# EAGLE schematic Wheelchair (EAGLE 5.11)
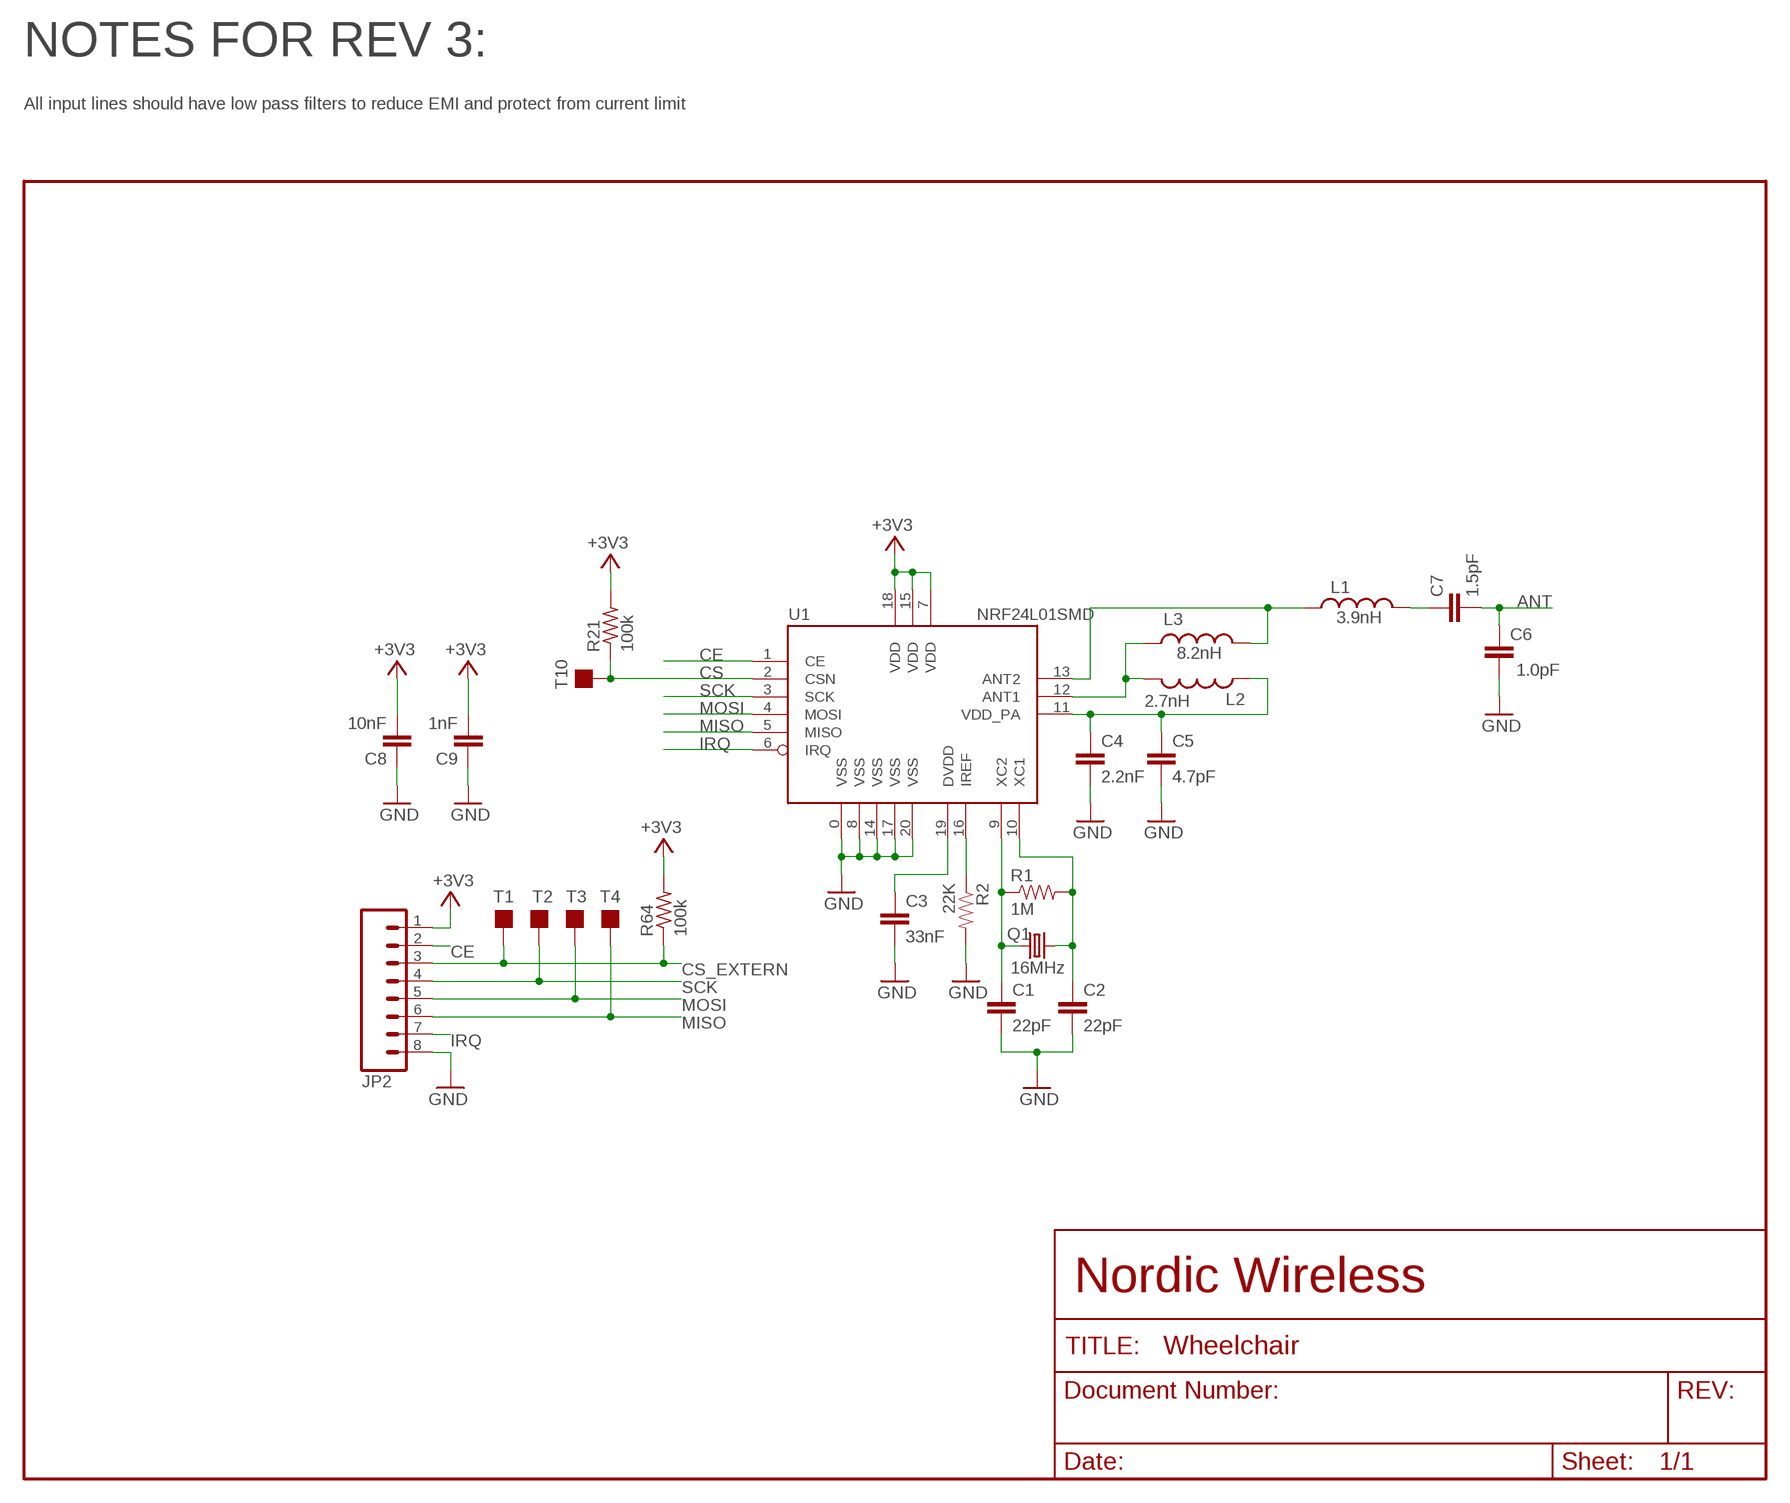
[diagram p0: schematic, sheet 1, part 1 of 3]
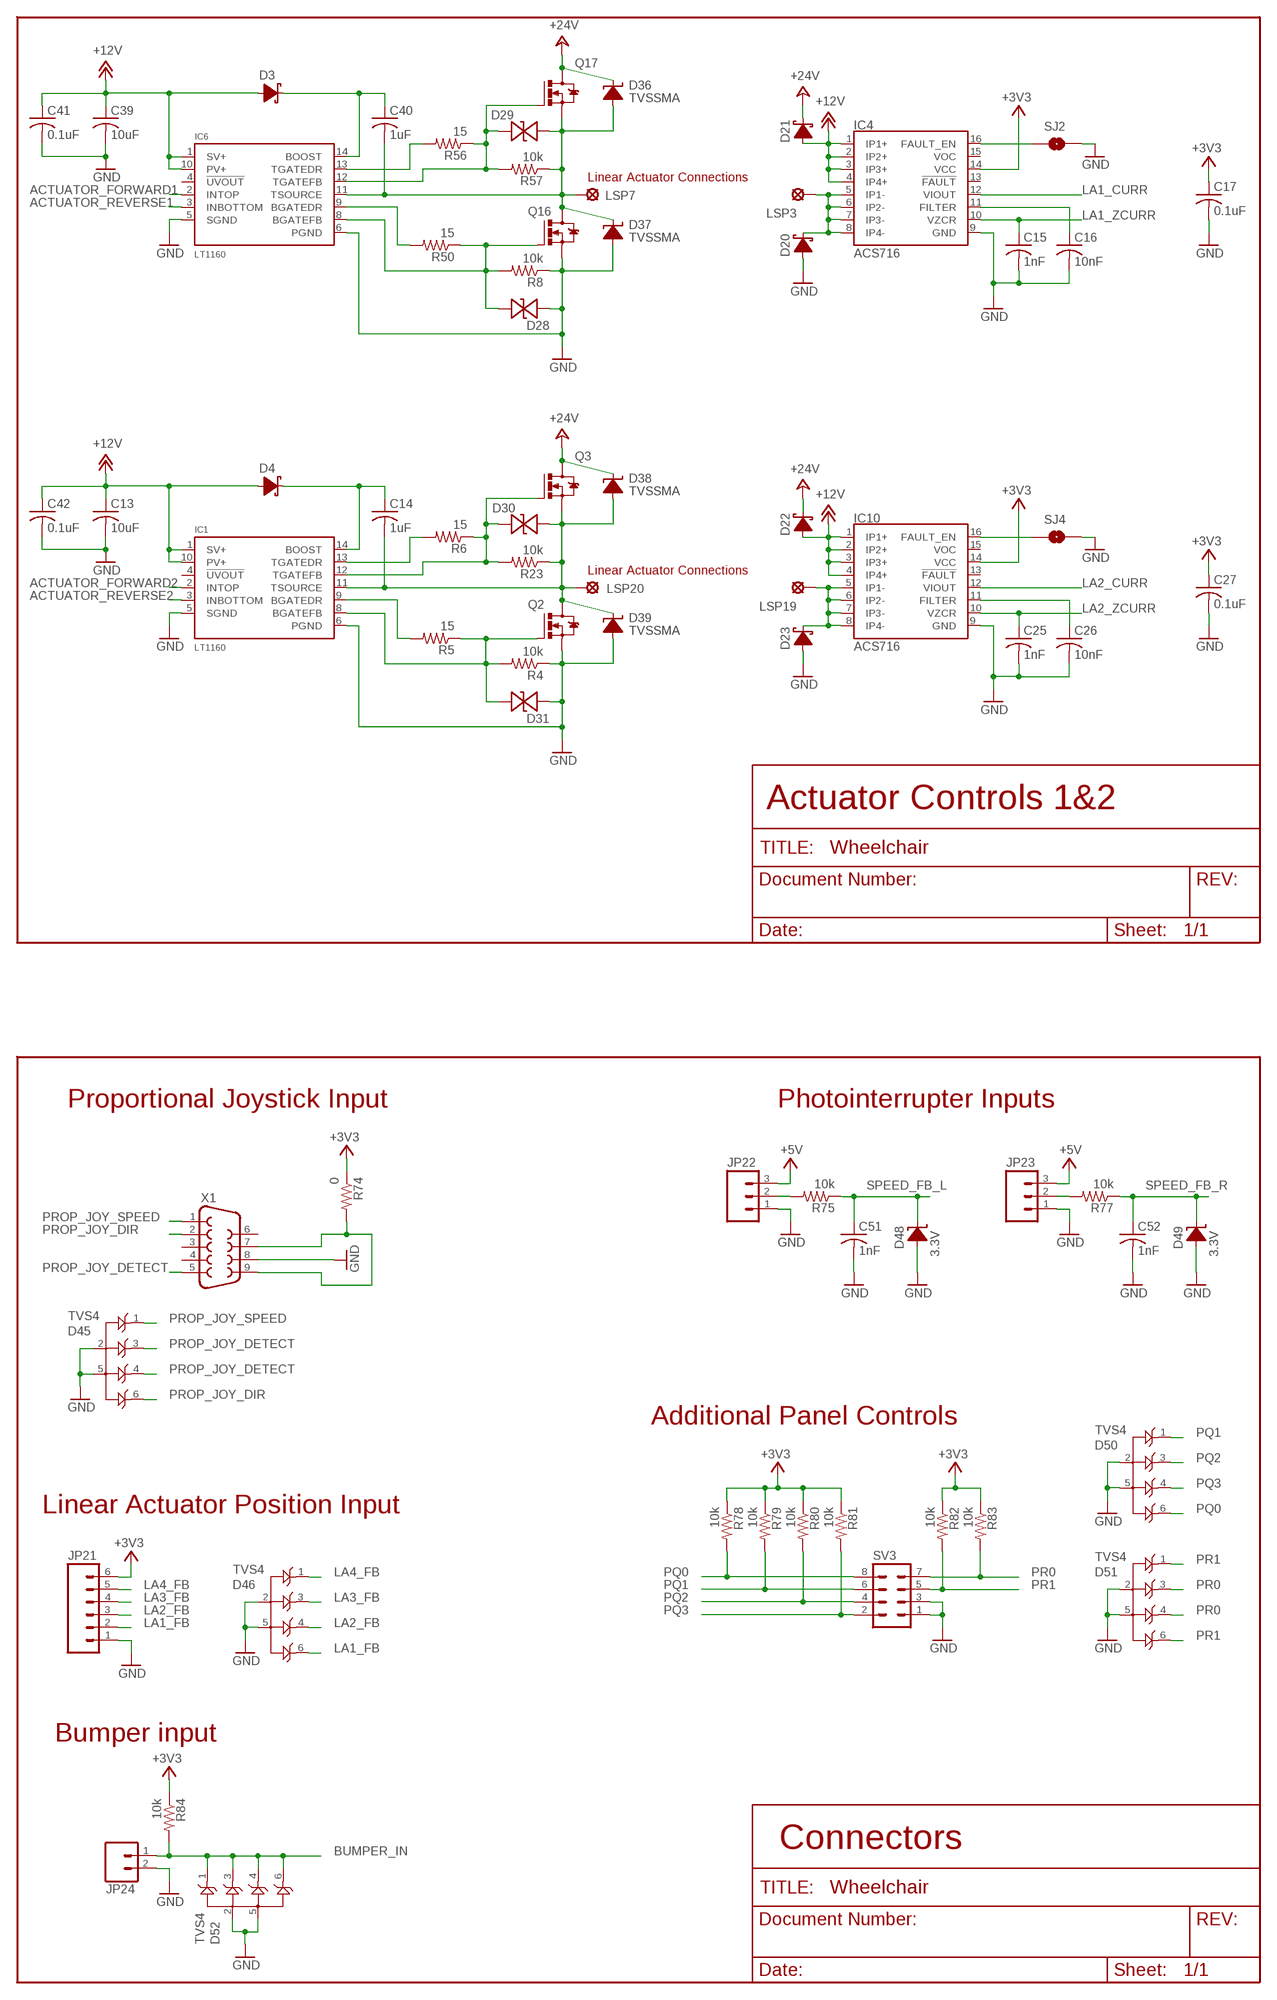
[diagram p1: schematic, sheet 1, part 2 of 3]
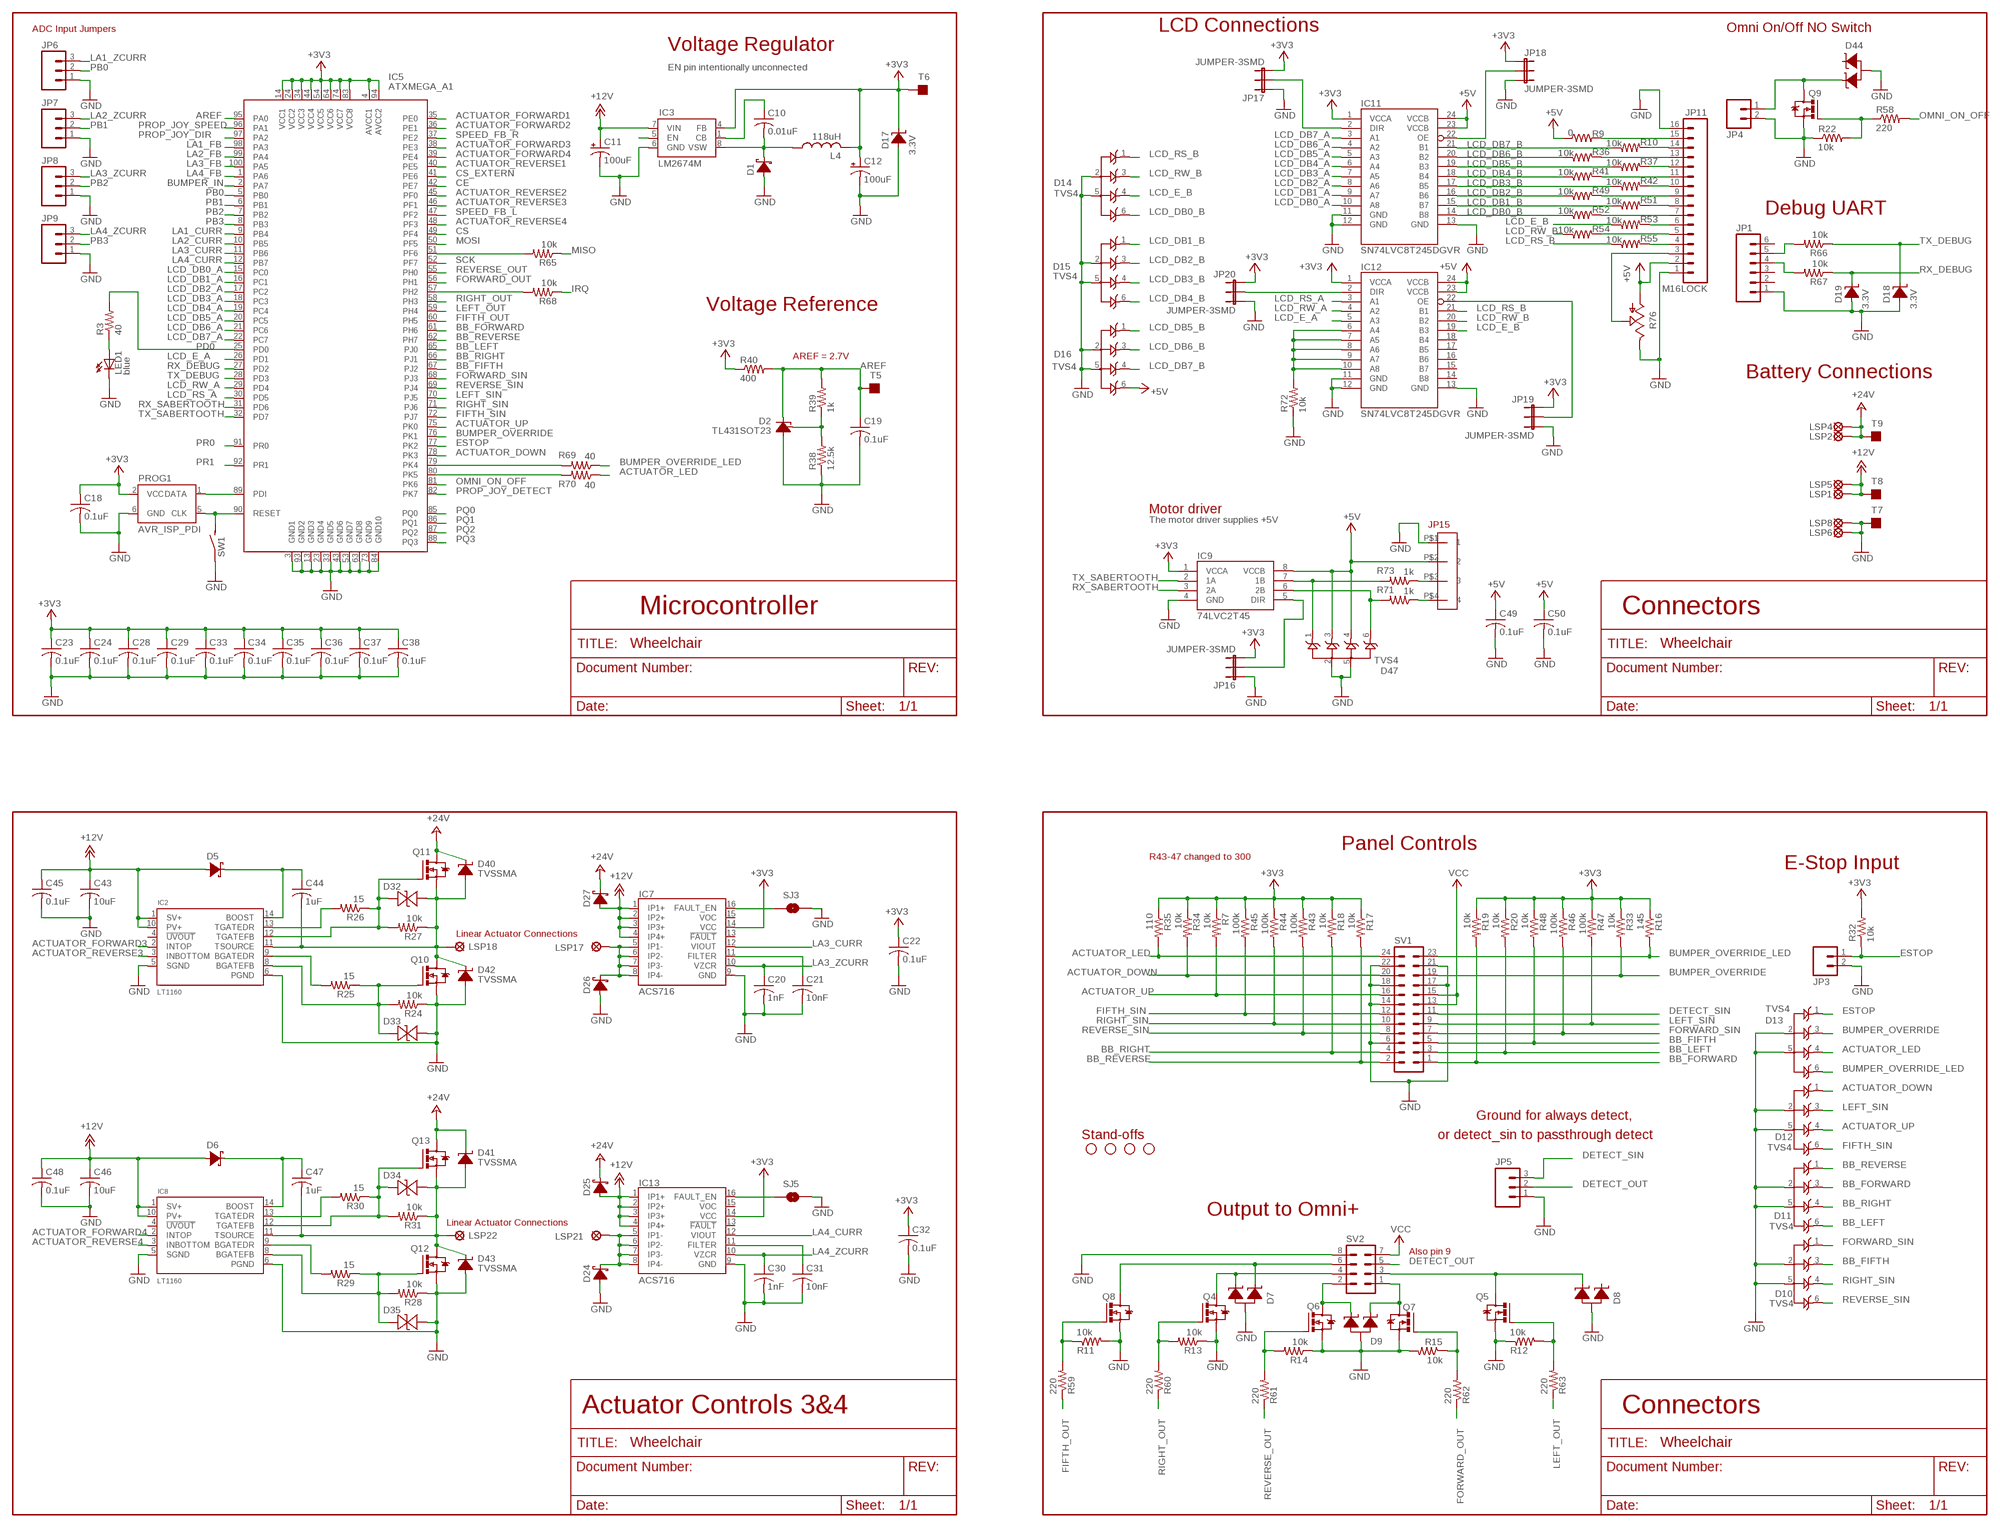
[diagram p2: schematic, sheet 1, part 3 of 3]

## Parts
C1  22pF  CAP0402  [C0402]
C2  22pF  CAP0402  [C0402]
C3  33nF  CAP0402  [C0402]
C4  2.2nF  CAP0402  [C0402]
C5  4.7pF  CAP0402  [C0402]
C6  1.0pF  CAP0402  [C0402]
C7  1.5pF  CAP0402  [C0402]
C8  10nF  CAP0402  [C0402]
C9  1nF  CAP0402  [C0402]
C10  0.01uF  C-USC0805  [C0805]
C11  100uF  CPOL-US2312  [CPOL2312]
C12  100uF  CPOL-US2312  [CPOL2312]
C13  10uF  C-USC0805  [C0805]
C14  1uF  C-USC0805  [C0805]
C15  1nF  C-USC0805  [C0805]
C16  10nF  C-USC0805  [C0805]
C17  0.1uF  C-USC0805  [C0805]
C18  0.1uF  C-USC0805  [C0805]
C19  0.1uF  C-USC0805  [C0805]
C20  1nF  C-USC0805  [C0805]
C21  10nF  C-USC0805  [C0805]
C22  0.1uF  C-USC0805  [C0805]
C23  0.1uF  C-USC0805  [C0805]
C24  0.1uF  C-USC0805  [C0805]
C25  1nF  C-USC0805  [C0805]
C26  10nF  C-USC0805  [C0805]
C27  0.1uF  C-USC0805  [C0805]
C28  0.1uF  C-USC0805  [C0805]
C29  0.1uF  C-USC0805  [C0805]
C30  1nF  C-USC0805  [C0805]
C31  10nF  C-USC0805  [C0805]
C32  0.1uF  C-USC0805  [C0805]
C33  0.1uF  C-USC0805  [C0805]
C34  0.1uF  C-USC0805  [C0805]
C35  0.1uF  C-USC0805  [C0805]
C36  0.1uF  C-USC0805  [C0805]
C37  0.1uF  C-USC0805  [C0805]
C38  0.1uF  C-USC0805  [C0805]
C39  10uF  C-USC0805  [C0805]
C40  1uF  C-USC0805  [C0805]
C41  0.1uF  C-USC0805  [C0805]
C42  0.1uF  C-USC0805  [C0805]
C43  10uF  C-USC0805  [C0805]
C44  1uF  C-USC0805  [C0805]
C45  0.1uF  C-USC0805  [C0805]
C46  10uF  C-USC0805  [C0805]
C47  1uF  C-USC0805  [C0805]
C48  0.1uF  C-USC0805  [C0805]
C49  0.1uF  C-USC0805  [C0805]
C50  0.1uF  C-USC0805  [C0805]
C51  1nF  C-USC0805  [C0805]
C52  1nF  C-USC0805  [C0805]
D1  DIODE-SCHOTTKYSMA  [SMA]
D2  TL431SOT23  [SOT-23]
D3  DIODE-SCHOTTKYSMA  [SMA]
D4  DIODE-SCHOTTKYSMA  [SMA]
D5  DIODE-SCHOTTKYSMA  [SMA]
D6  DIODE-SCHOTTKYSMA  [SMA]
D7  ZENER_COMMON_ANODE  [SOT23]
D8  ZENER_COMMON_ANODE  [SOT23]
D9  ZENER_COMMON_ANODE  [SOT23]
D10  TVS4  [SC89]
D11  TVS4  [SC89]
D12  TVS4  [SC89]
D13  TVS4  [SC89]
D14  TVS4  [SC89]
D15  TVS4  [SC89]
D16  TVS4  [SC89]
D17  3.3V  ZENERMINIMELF  [MINIMELF]
D18  3.3V  ZENERMINIMELF  [MINIMELF]
D19  3.3V  ZENERMINIMELF  [MINIMELF]
D20  DIODE-SCHOTTKYSMC  [SMC]
D21  DIODE-SCHOTTKYSMC  [SMC]
D22  DIODE-SCHOTTKYSMC  [SMC]
D23  DIODE-SCHOTTKYSMC  [SMC]
D24  DIODE-SCHOTTKYSMC  [SMC]
D25  DIODE-SCHOTTKYSMC  [SMC]
D26  DIODE-SCHOTTKYSMC  [SMC]
D27  DIODE-SCHOTTKYSMC  [SMC]
D28  TVSBISMB  [SMBBI]
D29  TVSBISMB  [SMBBI]
D30  TVSBISMB  [SMBBI]
D31  TVSBISMB  [SMBBI]
D32  TVSBISMB  [SMBBI]
D33  TVSBISMB  [SMBBI]
D34  TVSBISMB  [SMBBI]
D35  TVSBISMB  [SMBBI]
D36  TVSSMA  [SMA]
D37  TVSSMA  [SMA]
D38  TVSSMA  [SMA]
D39  TVSSMA  [SMA]
D40  TVSSMA  [SMA]
D41  TVSSMA  [SMA]
D42  TVSSMA  [SMA]
D43  TVSSMA  [SMA]
D44  ZENER_COMMON_ANODE  [SOT23]
D45  TVS4  [SC89]
D46  TVS4  [SC89]
D47  TVS4  [SC89]
D48  3.3V  ZENERMINIMELF  [MINIMELF]
D49  3.3V  ZENERMINIMELF  [MINIMELF]
D50  TVS4  [SC89]
D51  TVS4  [SC89]
D52  TVS4  [SC89]
IC1  LT1160  [SO14]
IC2  LT1160  [SO14]
IC3  LM2674M  [SOIC8_3.9MM]
IC4  ACS716  ACS710  [SOIC16W]
IC5  ATXMEGA_A1  [TQFP100]
IC6  LT1160  [SO14]
IC7  ACS716  ACS710  [SOIC16W]
IC8  LT1160  [SO14]
IC9  74LVC2T45  74LVC2T45DC  [VSSOP8]
IC10  ACS716  ACS710  [SOIC16W]
IC11  SN74LVC8T245DGVR  [TVSOP24]
IC12  SN74LVC8T245DGVR  [TVSOP24]
IC13  ACS716  ACS710  [SOIC16W]
JP1  M06LOCK  [1X06_LOCK]
JP2  M08LOCK  [1X08_LOCK]
JP3  M02PTH  [1X02]
JP4  M02PTH  [1X02]
JP5  M03LOCK  [1X03_LOCK]
JP6  M03LOCK  [1X03_LOCK]
JP7  M03LOCK  [1X03_LOCK]
JP8  M03LOCK  [1X03_LOCK]
JP9  M03LOCK  [1X03_LOCK]
JP10  STAND-OFF  [STAND-OFF]
JP11  M16LOCK  [1X16_LOCK]
JP12  STAND-OFF  [STAND-OFF]
JP13  STAND-OFF  [STAND-OFF]
JP14  STAND-OFF  [STAND-OFF]
JP15  4PINH0.197  [4PINH0.197]
JP16  JUMPER-3SMD  [SJ_3]
JP17  JUMPER-3SMD  [SJ_3]
JP18  JUMPER-3SMD  [SJ_3]
JP19  JUMPER-3SMD  [SJ_3]
JP20  JUMPER-3SMD  [SJ_3]
JP21  M06LOCK  [1X06_LOCK]
JP22  M03LOCK  [1X03_LOCK]
JP23  M03LOCK  [1X03_LOCK]
JP24  M02PTH  [1X02]
L1  3.9nH  INDUCTOR0402  [C0402]
L2  2.7nH  INDUCTOR0402  [C0402]
L3  8.2nH  INDUCTOR0402  [C0402]
L4  118uH  L-USLCI  [LCI_SERIES_PULSE_EGR]
LED1  blue  LED0805  [D0805]
LSP1  SE14  [SE14]
LSP2  SE14  [SE14]
LSP3  SE14  [SE14]
LSP4  SE14  [SE14]
LSP5  SE14  [SE14]
LSP6  SE14  [SE14]
LSP7  SE14  [SE14]
LSP8  SE14  [SE14]
LSP17  SE14  [SE14]
LSP18  SE14  [SE14]
LSP19  SE14  [SE14]
LSP20  SE14  [SE14]
LSP21  SE14  [SE14]
LSP22  SE14  [SE14]
PROG1  AVR_ISP_PDI  [CON6P2R]
Q1  16MHz  CRYSTAL5X3  [CRYSTAL-SMD-5X3]
Q2  MOSFET-NTO252  [TO252]
Q3  MOSFET-NTO252  [TO252]
Q4  MOSFET-N.SOT23  [SOT-23]
Q5  MOSFET-N.SOT23  [SOT-23]
Q6  MOSFET-N.SOT23  [SOT-23]
Q7  MOSFET-N.SOT23  [SOT-23]
Q8  MOSFET-N.SOT23  [SOT-23]
Q9  MOSFET-N.SOT23  [SOT-23]
Q10  MOSFET-NTO252  [TO252]
Q11  MOSFET-NTO252  [TO252]
Q12  MOSFET-NTO252  [TO252]
Q13  MOSFET-NTO252  [TO252]
Q16  MOSFET-NTO252  [TO252]
Q17  MOSFET-NTO252  [TO252]
R1  1M  RESISTOR0402  [C0402]
R2  22K  RESISTOR0402  [C0402]
R3  40  R-US_R0805  [R0805]
R4  10k  R-US_R0805  [R0805]
R5  15  R-US_R0805  [R0805]
R6  15  R-US_R0805  [R0805]
R7  10k  R-US_R0805  [R0805]
R8  10k  R-US_R0805  [R0805]
R9  0  R-US_R0805  [R0805]
R10  10k  R-US_R0805  [R0805]
R11  10k  R-US_R0805  [R0805]
R12  10k  R-US_R0805  [R0805]
R13  10k  R-US_R0805  [R0805]
R14  10k  R-US_R0805  [R0805]
R15  10k  R-US_R0805  [R0805]
R16  145  R-US_R0805  [R0805]
R17  10k  R-US_R0805  [R0805]
R18  10k  R-US_R0805  [R0805]
R19  10k  R-US_R0805  [R0805]
R20  10k  R-US_R0805  [R0805]
R21  100k  R-US_R0805  [R0805]
R22  10k  R-US_R0805  [R0805]
R23  10k  R-US_R0805  [R0805]
R24  10k  R-US_R0805  [R0805]
R25  15  R-US_R0805  [R0805]
R26  15  R-US_R0805  [R0805]
R27  10k  R-US_R0805  [R0805]
R28  10k  R-US_R0805  [R0805]
R29  15  R-US_R0805  [R0805]
R30  15  R-US_R0805  [R0805]
R31  10k  R-US_R0805  [R0805]
R32  10k  R-US_R0805  [R0805]
R33  10k  R-US_R0805  [R0805]
R34  10k  R-US_R0805  [R0805]
R35  110  R-US_R0805  [R0805]
R36  10k  R-US_R0805  [R0805]
R37  10k  R-US_R0805  [R0805]
R38  12.5k  R-US_R0805  [R0805]
R39  1k  R-US_R0805  [R0805]
R40  400  R-US_R0805  [R0805]
R41  10k  R-US_R0805  [R0805]
R42  10k  R-US_R0805  [R0805]
R43  100k  R-US_R0805  [R0805]
R44  100k  R-US_R0805  [R0805]
R45  100k  R-US_R0805  [R0805]
R46  100k  R-US_R0805  [R0805]
R47  100k  R-US_R0805  [R0805]
R48  10k  R-US_R0805  [R0805]
R49  10k  R-US_R0805  [R0805]
R50  15  R-US_R0805  [R0805]
R51  10k  R-US_R0805  [R0805]
R52  10k  R-US_R0805  [R0805]
R53  10k  R-US_R0805  [R0805]
R54  10k  R-US_R0805  [R0805]
R55  10k  R-US_R0805  [R0805]
R56  15  R-US_R0805  [R0805]
R57  10k  R-US_R0805  [R0805]
R58  220  R-US_R0805  [R0805]
R59  220  R-US_R0805  [R0805]
R60  220  R-US_R0805  [R0805]
R61  220  R-US_R0805  [R0805]
R62  220  R-US_R0805  [R0805]
R63  220  R-US_R0805  [R0805]
R64  100k  R-US_R0805  [R0805]
R65  10k  R-US_R0805  [R0805]
R66  10k  R-US_R0805  [R0805]
R67  10k  R-US_R0805  [R0805]
R68  10k  R-US_R0805  [R0805]
R69  40  R-US_R0805  [R0805]
R70  40  R-US_R0805  [R0805]
R71  1k  R-US_R0805  [R0805]
R72  10k  R-US_R0805  [R0805]
R73  1k  R-US_R0805  [R0805]
R74  0  R-US_R0805  [R0805]
R75  10k  R-US_R0805  [R0805]
R76  TRIM_US-B25P  [B25P]
R77  10k  R-US_R0805  [R0805]
R78  10k  R-US_R0805  [R0805]
R79  10k  R-US_R0805  [R0805]
R80  10k  R-US_R0805  [R0805]
R81  10k  R-US_R0805  [R0805]
R82  10k  R-US_R0805  [R0805]
R83  10k  R-US_R0805  [R0805]
R84  10k  R-US_R0805  [R0805]
SJ2  SOLDERJUMPERNO  [SJ_2S-NO]
SJ3  SOLDERJUMPERNO  [SJ_2S-NO]
SJ4  SOLDERJUMPERNO  [SJ_2S-NO]
SJ5  SOLDERJUMPERNO  [SJ_2S-NO]
SV1  MA12-2  [MA12-2]
SV2  MA04-2  [MA04-2]
SV3  MA04-2  [MA04-2]
SW1  TL1015  [TL1015]
T1  TESTPOINT40  [TP40MIL]
T2  TESTPOINT40  [TP40MIL]
T3  TESTPOINT40  [TP40MIL]
T4  TESTPOINT40  [TP40MIL]
T5  TESTPOINT40  [TP40MIL]
T6  TESTPOINT40  [TP40MIL]
T7  TESTPOINT40  [TP40MIL]
T8  TESTPOINT40  [TP40MIL]
T9  TESTPOINT40  [TP40MIL]
T10  TESTPOINT40  [TP40MIL]
U1  NRF24L01SMD  [QFN20]
X1  F09V  [F09V]

## Nets
3V3ONOFF: IC3.5(EN)
+3V3: C8.2 C9.2 C12.+ C17.1 C18.1 C22.1 C23.1 C24.1 C27.1 C28.1 C29.1 C32.1 C33.1 C34.1 C35.1 C36.1 C37.1 C38.1 D17.C IC3.4(FB) IC4.14(VCC) IC5.4(AVCC1) IC5.14(VCC1) IC5.24(VCC2) IC5.34(VCC3) IC5.44(VCC4) IC5.54(VCC5) IC5.64(VCC6) IC5.74(VCC7) IC5.83(VCC8) IC5.94(AVCC2) IC7.14(VCC) IC9.1(VCCA) IC10.14(VCC) IC11.1(VCCA) IC12.1(VCCA) IC13.14(VCC) JP2.1 JP16.3 JP17.3 JP18.1 JP19.1 JP20.1 JP21.6 L4.P$2 PROG1.2(VCC) R7.1 R16.1 R17.1 R18.1 R19.1 R20.1 R21.2 R32.2 R33.1 R34.1 R35.1 R40.1 R43.1 R44.1 R45.1 R46.1 R47.1 R48.1 R64.2 R74.1 R78.1 R79.1 R80.1 R81.1 R82.1 R83.1 R84.1 T6.1 U1.7(VDD) U1.15(VDD) U1.18(VDD)
+5V: C49.1 C50.1 D16.6 D47.3 D47.4 IC9.8(VCCB) IC11.23(VCCB) IC11.24(VCCB) IC12.23(VCCB) IC12.24(VCCB) JP11.2 JP15.P$2 JP22.3 JP23.3 R9.1 R76.A
+12V: C11.+ C13.1 C39.1 C41.1 C42.1 C43.1 C45.1 C46.1 C48.1 D3.A D4.A D5.A D6.A D21.A D22.A D25.A D27.A IC1.1(SV+) IC1.10(PV+) IC2.1(SV+) IC2.10(PV+) IC3.7(VIN) IC4.1(IP1+) IC4.2(IP2+) IC4.3(IP3+) IC4.4(IP4+) IC6.1(SV+) IC6.10(PV+) IC7.1(IP1+) IC7.2(IP2+) IC7.3(IP3+) IC7.4(IP4+) IC8.1(SV+) IC8.10(PV+) IC10.1(IP1+) IC10.2(IP2+) IC10.3(IP3+) IC10.4(IP4+) IC13.1(IP1+) IC13.2(IP2+) IC13.3(IP3+) IC13.4(IP4+) LSP1.MP LSP5.MP T8.1
+24V: D21.C D22.C D25.C D27.C D36.C D38.C D40.C D41.C LSP2.MP LSP4.MP Q3.3(D) Q11.3(D) Q13.3(D) Q17.3(D) T9.1
ACTUATOR_DOWN: D12.1 IC5.78(PK3) R34.2 SV1.20
ACTUATOR_FORWARD1: IC5.35(PE0) IC6.2(INTOP)
ACTUATOR_FORWARD2: IC1.2(INTOP) IC5.36(PE1)
ACTUATOR_FORWARD3: IC2.2(INTOP) IC5.38(PE3)
ACTUATOR_FORWARD4: IC5.39(PE4) IC8.2(INTOP)
ACTUATOR_LED: D13.4 R35.2 R70.1 SV1.24
ACTUATOR_REVERSE1: IC5.40(PE5) IC6.3(INBOTTOM)
ACTUATOR_REVERSE2: IC1.3(INBOTTOM) IC5.45(PF0)
ACTUATOR_REVERSE3: IC2.3(INBOTTOM) IC5.46(PF1)
ACTUATOR_REVERSE4: IC5.48(PF3) IC8.3(INBOTTOM)
ACTUATOR_UP: D12.4 IC5.75(PK0) R7.2 SV1.16
ANT: C6.2 C7.2
AREF: C19.1 D2.1(K) IC5.95(PA0) R39.2 R40.2 T5.1
BB_FIFTH: D10.3 IC5.67(PJ2) R48.2 SV1.5
BB_FORWARD: D11.3 IC5.61(PH6) R19.2 SV1.1
BB_LEFT: D11.6 IC5.65(PJ0) R20.2 SV1.3
BB_REVERSE: D11.1 IC5.62(PH7) R17.2 SV1.2
BB_RIGHT: D11.4 IC5.66(PJ1) R18.2 SV1.4
BUMPER_IN: D52.1 D52.3 D52.4 D52.6 IC5.2(PA7) JP24.1 R84.2
BUMPER_OVERRIDE: D13.3 IC5.76(PK1) R33.2 SV1.19
BUMPER_OVERRIDE_LED: D13.6 R16.2 R69.1 SV1.23
CE: IC5.42(PE7) JP2.2 U1.1(CE)
CS: IC5.49(PF4) R21.1 T10.1 U1.2(CSN)
CS_EXTERN: IC5.41(PE6) JP2.3 R64.1 T1.1
DETECT_OUT: JP5.2 SV2.5
DETECT_SIN: JP5.3 SV1.11
ESTOP: D13.1 IC5.77(PK2) JP3.1 R32.1
FIFTH_OUT: IC5.60(PH5) R59.1
FIFTH_SIN: D12.6 IC5.72(PJ7) R45.2 SV1.12
FORWARD_OUT: IC5.56(PH1) R62.1
FORWARD_SIN: D10.1 IC5.68(PJ3) R46.2 SV1.7
GND: C1.2 C2.2 C3.2 C4.2 C5.2 C6.1 C8.1 C9.1 C11.- C12.- C13.2 C15.2 C16.2 C17.2 C18.2 C19.2 C20.2 C21.2 C22.2 C23.2 C24.2 C25.2 C26.2 C27.2 C28.2 C29.2 C30.2 C31.2 C32.2 C33.2 C34.2 C35.2 C36.2 C37.2 C38.2 C39.2 C41.2 C42.2 C43.2 C45.2 C46.2 C48.2 C49.2 C50.2 C51.2 C52.2 D1.A D2.3(A) D7.3(A) D8.3(A) D9.3(A) D10.2(GND) D10.5(GND) D11.2(GND) D11.5(GND) D12.2(GND) D12.5(GND) D13.2(GND) D13.5(GND) D14.2(GND) D14.5(GND) D15.2(GND) D15.5(GND) D16.2(GND) D16.5(GND) D17.A D18.A D19.A D20.A D23.A D24.A D26.A D28.A D31.A D33.A D35.A D37.A D39.A D42.A D43.A D44.3(A) D45.2(GND) D45.5(GND) D46.2(GND) D46.5(GND) D47.2(GND) D47.5(GND) D48.A D49.A D50.2(GND) D50.5(GND) D51.2(GND) D51.5(GND) D52.2(GND) D52.5(GND) IC1.5(SGND) IC1.6(PGND) IC2.5(SGND) IC2.6(PGND) IC3.6(GND) IC4.9(GND) IC5.3(GND1) IC5.13(GND3) IC5.23(GND4) IC5.33(GND5) IC5.43(GND6) IC5.53(GND7) IC5.63(GND8) IC5.73(GND9) IC5.84(GND10) IC5.93(GND2) IC6.5(SGND) IC6.6(PGND) IC7.9(GND) IC8.5(SGND) IC8.6(PGND) IC9.4(GND) IC10.9(GND) IC11.11(GND) IC11.12(GND) IC11.13(GND) IC12.11(GND) IC12.12(GND) IC12.13(GND) IC13.9(GND) JP1.1 JP2.8 JP3.2 JP4.2 JP5.1 JP6.1 JP7.1 JP8.1 JP9.1 JP11.1 JP11.16 JP15.P$1 JP16.1 JP17.1 JP18.3 JP19.3 JP20.3 JP21.1 JP22.1 JP23.1 JP24.2 LED1.C(K) LSP6.MP LSP8.MP PROG1.6(GND) Q2.2(S) Q4.2(S) Q5.2(S) Q6.2(S) Q7.2(S) Q8.2(S) Q9.2(S) Q10.2(S) Q12.2(S) Q16.2(S) R2.2 R4.1 R8.1 R11.2 R12.1 R13.1 R14.1 R15.2 R22.1 R24.1 R28.1 R38.1 R72.1 R76.E SJ2.2 SJ3.2 SJ4.2 SJ5.2 SV1.6 SV1.14 SV1.17 SV1.18 SV1.21 SV1.22 SV2.8 SV3.1 SV3.3 SW1.P$1 T7.1 U1.0(VSS) U1.8(VSS) U1.14(VSS) U1.17(VSS) U1.20(VSS) X1.8
IRQ: JP2.7 R68.1 U1.6(IRQ)
LA1: C40.2 D29.A D36.A D37.C IC6.11(TSOURCE) LSP7.MP Q16.3(D) Q17.2(S) R57.1
LA1_CURR: IC4.12(VIOUT) IC5.9(PB4)
LA1_FB: D46.6 IC5.98(PA3) JP21.2
LA1_ZCURR: C15.1 IC4.10(VZCR) JP6.3
LA2: C14.2 D30.A D38.A D39.C IC1.11(TSOURCE) LSP20.MP Q2.3(D) Q3.2(S) R23.1
LA2_CURR: IC5.10(PB5) IC10.12(VIOUT)
LA2_FB: D46.4 IC5.99(PA4) JP21.3
LA2_ZCURR: C25.1 IC10.10(VZCR) JP7.3
LA3: C44.2 D32.A D40.A D42.C IC2.11(TSOURCE) LSP18.MP Q10.3(D) Q11.2(S) R27.1
LA3_CURR: IC5.11(PB6) IC7.12(VIOUT)
LA3_FB: D46.3 IC5.100(PA5) JP21.4
LA3_ZCURR: C20.1 IC7.10(VZCR) JP8.3
LA4: C47.2 D34.A D41.A D43.C IC8.11(TSOURCE) LSP22.MP Q12.3(D) Q13.2(S) R31.1
LA4_CURR: IC5.12(PB7) IC13.12(VIOUT)
LA4_FB: D46.1 IC5.1(PA6) JP21.5
LA4_ZCURR: C30.1 IC13.10(VZCR) JP9.3
LCD_ANODE: JP11.15 R9.2
LCD_CONTRAST: JP11.3 R76.S
LCD_DB0_A: IC5.15(PC0) IC11.10(A8)
LCD_DB0_B: D14.6 IC11.14(B8) R52.1
LCD_DB1_A: IC5.16(PC1) IC11.9(A7)
LCD_DB1_B: D15.1 IC11.15(B7) R51.1
LCD_DB2_A: IC5.17(PC2) IC11.8(A6)
LCD_DB2_B: D15.3 IC11.16(B6) R49.1
LCD_DB3_A: IC5.18(PC3) IC11.7(A5)
LCD_DB3_B: D15.4 IC11.17(B5) R42.1
LCD_DB4_A: IC5.19(PC4) IC11.6(A4)
LCD_DB4_B: D15.6 IC11.18(B4) R41.1
LCD_DB5_A: IC5.20(PC5) IC11.5(A3)
LCD_DB5_B: D16.1 IC11.19(B3) R37.1
LCD_DB6_A: IC5.21(PC6) IC11.4(A2)
LCD_DB6_B: D16.3 IC11.20(B2) R36.1
LCD_DB7_A: IC5.22(PC7) IC11.3(A1)
LCD_DB7_B: D16.4 IC11.21(B1) R10.1
LCD_E_A: IC5.26(PD1) IC12.5(A3)
LCD_E_B: D14.4 IC12.19(B3) R53.1
LCD_RS_A: IC5.30(PD5) IC12.3(A1)
LCD_RS_B: D14.1 IC12.21(B1) R55.1
LCD_RW_A: IC5.29(PD4) IC12.4(A2)
LCD_RW_B: D14.3 IC12.20(B2) R54.1
LEFT_OUT: IC5.59(PH4) R63.1
LEFT_SIN: D12.3 IC5.70(PJ5) R47.2 SV1.9
MISO: JP2.6 R65.1 T4.1 U1.5(MISO)
MOSI: IC5.50(PF5) JP2.5 T3.1 U1.4(MOSI)
N$1: C1.1 Q1.1 R1.1 U1.9(XC2)
N$2: C2.1 Q1.3 R1.2 U1.10(XC1)
N$3: L2.2 L3.1 U1.12(ANT1)
N$4: R2.1 U1.16(IREF)
N$5: C3.1 U1.19(DVDD)
N$6: L1.1 L3.2 U1.13(ANT2)
N$7: C4.1 C5.1 L2.1 U1.11(VDD_PA)
N$8: LED1.A R3.1
N$9: C7.1 L1.2
N$10: C14.1 D4.C IC1.14(BOOST)
N$11: JP1.4 R67.2
N$12: D44.1(C1) JP4.1 Q9.3(D)
N$13: IC1.9(BGATEDR) R5.2
N$14: D7.2(C2) Q8.3(D) SV2.6
N$15: D7.1(C1) Q4.3(D) SV2.4
N$16: D29.K(C) IC6.12(TGATEFB) Q17.1(G) R56.1 R57.2
N$17: D8.1(C1) Q5.3(D) SV2.3
N$18: C10.2 D1.C IC3.8(VSW) L4.P$1
N$19: C10.1 IC3.1(CB)
N$20: D9.1(C1) Q6.3(D) SV2.2
N$21: D9.2(C2) Q7.3(D) SV2.1
N$22: D20.C IC4.5(IP1-) IC4.6(IP2-) IC4.7(IP3-) IC4.8(IP4-) LSP3.MP
N$23: C16.1 IC4.11(FILTER)
N$24: IC4.16(FAULT_EN) SJ2.1
N$25: D31.K(C) IC1.8(BGATEFB) Q2.1(G) R4.2 R5.1
N$26: D2.2(J) R38.2 R39.1
N$27: D30.K(C) IC1.12(TGATEFB) Q3.1(G) R6.1 R23.2
N$28: IC1.13(TGATEDR) R6.2
N$29: D26.C IC7.5(IP1-) IC7.6(IP2-) IC7.7(IP3-) IC7.8(IP4-) LSP17.MP
N$30: C21.1 IC7.11(FILTER)
N$31: IC7.16(FAULT_EN) SJ3.1
N$32: C44.1 D5.C IC2.14(BOOST)
N$33: C40.1 D3.C IC6.14(BOOST)
N$34: JP1.5 R66.2
N$35: IC2.9(BGATEDR) R25.2
N$36: D23.C IC10.5(IP1-) IC10.6(IP2-) IC10.7(IP3-) IC10.8(IP4-) LSP19.MP
N$37: C26.1 IC10.11(FILTER)
N$38: IC10.16(FAULT_EN) SJ4.1
N$39: D33.K(C) IC2.8(BGATEFB) Q10.1(G) R24.2 R25.1
N$40: IC5.57(PH2) R68.2
N$41: D32.K(C) IC2.12(TGATEFB) Q11.1(G) R26.1 R27.2
N$42: IC2.13(TGATEDR) R26.2
N$43: D24.C IC13.5(IP1-) IC13.6(IP2-) IC13.7(IP3-) IC13.8(IP4-) LSP21.MP
N$44: C31.1 IC13.11(FILTER)
N$45: IC13.16(FAULT_EN) SJ5.1
N$46: IC5.89(PDI) PROG1.1(DATA)
N$47: IC5.90(RESET) PROG1.5(CLK) SW1.P$2
N$48: JP15.P$3 R73.1
N$49: IC5.79(PK4) R69.2
N$50: IC5.80(PK5) R70.2
N$51: JP15.P$4 R71.1
N$52: IC6.9(BGATEDR) R50.2
N$53: D47.1 IC9.7(1B) R73.2
N$54: D28.K(C) IC6.8(BGATEFB) Q16.1(G) R8.2 R50.1
N$55: IC6.13(TGATEDR) R56.2
N$56: C47.1 D6.C IC8.14(BOOST)
N$57: D47.6 IC9.6(2B) R71.2
N$58: IC8.9(BGATEDR) R29.2
N$59: D35.K(C) IC8.8(BGATEFB) Q12.1(G) R28.2 R29.1
N$60: D34.K(C) IC8.12(TGATEFB) Q13.1(G) R30.1 R31.2
N$61: IC8.13(TGATEDR) R30.2
N$62: Q9.1(G) R22.2 R58.1
N$63: Q8.1(G) R11.1 R59.2
N$64: Q4.1(G) R13.2 R60.2
N$65: Q6.1(G) R14.2 R61.2
N$66: Q7.1(G) R15.1 R62.2
N$67: Q5.1(G) R12.2 R63.2
N$68: IC5.51(PF6) R65.2
N$69: IC9.5(DIR) JP16.2
N$70: JP11.12 R37.2
N$71: JP11.10 R42.2
N$72: JP11.14 R10.2
N$73: JP11.8 R51.2
N$74: JP11.13 R36.2
N$75: JP11.11 R41.2
N$76: JP11.9 R49.2
N$77: JP11.7 R52.2
N$78: JP11.6 R53.2
N$79: JP11.5 R54.2
N$80: JP11.4 R55.2
N$81: IC11.2(DIR) JP17.2
N$82: IC11.22(OE) JP18.2
N$83: R74.2 X1.7 X1.9
N$84: IC12.6(A4) IC12.7(A5) IC12.8(A6) IC12.9(A7) IC12.10(A8) R72.2
N$85: JP22.2 R75.2
N$86: JP23.2 R77.2
N$87: IC12.22(OE) JP19.2
N$88: IC12.2(DIR) JP20.2
OMNI_ON_OFF: IC5.81(PK6) R58.2
PB0: IC5.5(PB0) JP6.2
PB1: IC5.6(PB1) JP7.2
PB2: IC5.7(PB2) JP8.2
PB3: IC5.8(PB3) JP9.2
PD0: IC5.25(PD0) R3.2
PQ0: D50.6 IC5.85(PQ0) R78.2 SV3.8
PQ1: D50.1 IC5.86(PQ1) R79.2 SV3.6
PQ2: D50.3 IC5.87(PQ2) R80.2 SV3.4
PQ3: D50.4 IC5.88(PQ3) R81.2 SV3.2
PR0: D51.3 D51.4 IC5.91(PR0) R83.2 SV3.7
PR1: D51.1 D51.6 IC5.92(PR1) R82.2 SV3.5
PROP_JOY_DETECT: D45.3 D45.4 IC5.82(PK7) X1.5
PROP_JOY_DIR: D45.6 IC5.97(PA2) X1.2
PROP_JOY_SPEED: D45.1 IC5.96(PA1) X1.1
REVERSE_OUT: IC5.55(PH0) R61.1
REVERSE_SIN: D10.6 IC5.69(PJ4) R43.2 SV1.8
RIGHT_OUT: IC5.58(PH3) R60.1
RIGHT_SIN: D10.4 IC5.71(PJ6) R44.2 SV1.10
RX_DEBUG: D19.C IC5.27(PD2) R67.1
RX_SABERTOOTH: IC5.31(PD6) IC9.3(2A)
SCK: IC5.52(PF7) JP2.4 T2.1 U1.3(SCK)
SPEED_FB_L: C51.1 D48.C IC5.47(PF2) R75.1
SPEED_FB_R: C52.1 D49.C IC5.37(PE2) R77.1
TX_DEBUG: D18.C IC5.28(PD3) R66.1
TX_SABERTOOTH: IC5.32(PD7) IC9.2(1A)
VCC: SV1.13 SV1.15 SV2.7
Unconnected: D8.2(C2) D44.2(C2) IC1.4(!UVOUT) IC2.4(!UVOUT) IC4.13(!FAULT) IC4.15(VOC) IC6.4(!UVOUT) IC7.13(!FAULT) IC7.15(VOC) IC8.4(!UVOUT) IC10.13(!FAULT) IC10.15(VOC) IC12.14(B8) IC12.15(B7) IC12.16(B6) IC12.17(B5) IC12.18(B4) IC13.13(!FAULT) IC13.15(VOC) JP1.2 JP1.3 JP1.6 X1.3 X1.4 X1.6

## Notes on the sheet
- NOTES FOR REV 3:
- All input lines should have low pass filters to reduce EMI and protect from current limit
- ADC Input Jumpers | LCD Connections | Omni On/Off NO Switch
- Voltage Regulator
- EN pin intentionally unconnected
- Debug UART
- Voltage Reference
- AREF = 2.7V
- Battery Connections
- Motor driver
- The motor driver supplies +5V
- Nordic Wireless | Microcontroller | Connectors
- Panel Controls
- R43-47 changed to 300
- E-Stop Input
- Linear Actuator Connections | Linear Actuator Connections
- Ground for always detect,
- Stand-offs | or detect_sin to passthrough detect
- Output to Omni+
- Linear Actuator Connections
- Linear Actuator Connections
- Also pin 9
- Actuator Controls 1&2 | Actuator Controls 3&4 | Connectors
- Proportional Joystick Input | Photointerrupter Inputs
- Additional Panel Controls
- Linear Actuator Position Input
- Bumper input
- Connectors

## Library data of the parts
C1-C9 = SparkFun:CAP: Capacitor Standard 0603 ceramic capacitor, and 0.1" leaded capacitor.
C10 C13-C52 = rcl:C-US: CAPACITOR, American symbol
C11 C12 = Jeff:CPOL-US
D1 D3-D6 D20-D27 = ads4:DIODE-SCHOTTKY: Schottky Diode
D2 = ads4:TL431: TL431 Adjustable Shunt Regulator
D7-D9 D44 = vanossj:ZENER_COMMON_ANODE
D10-D16 D45-D47 D50-D52 = vanossj:TVS4
D17-D19 D48 D49 = ads4:ZENER: Zener Diode
D28-D35 = ads4:TVSBI: Bi-directional TVS
D36-D43 = ads4:TVS: 2-terminal Transient Voltage Suppressor
IC1 IC2 IC6 IC8 = vanossj:LT1160
IC3 = Jeff:LM2674M
IC4 IC7 IC10 IC13 = Jeff:ACS710
IC5 = vanossj:ATXMEGA_A1
IC9 = 74LVC2T45:74LVC2T45: 74LVC2T45 Dual supply translating transceiver; 3-state
IC11 IC12 = SN74LVC8T245:SN74LVC8T245: SN74LVC8T245 8-bit dual-supply bus transceiver with configurable voltage translation and 3-state outputs
JP1 = SparkFun110309:M06: Header 6 Standard 6-pin 0.1" header. Use with straight break away headers (SKU : PRT-00116), right angle break away headers (PRT-00553), swiss pins (PRT-00743), machine pins (PRT-00117), and female headers (PRT-00115). Molex polarized connector foot print use with SKU : PRT-08094 with associated crimp pins and housings. NOTES ON THE VARIANTS LOCK and LOCK_LONGPADS... This footprint was designed to help hold the alignment of a through-hole component (i.e. 6-pin header) while soldering it into place. You may notice that each hole has been shifted either up or down by 0.005 of an inch from it's more standard position (which is a perfectly straight line). This slight alteration caused the pins (the squares in the middle) to touch the edges of the holes. Because they are alternating, it causes a "brace" to hold the component in place. 0.005 has proven to be the perfect amount of "off-center" position when using our standard breakaway headers. Although looks a little odd when you look at the bare footprint, once you have a header in there, the alteration is very hard to notice. Also, if you push a header all the way into place, it is covered up entirely on the bottom side. This idea of altering the position of holes to aid alignment will be further integrated into the Sparkfun Library for other footprints. It can help hold any component with 3 or more connection pins.
JP2 = SparkFun110309:M08: Header 8 Standard 8-pin 0.1" header. Use with straight break away headers (SKU : PRT-00116), right angle break away headers (PRT-00553), swiss pins (PRT-00743), machine pins (PRT-00117), and female headers (PRT-00115).
JP3 JP4 JP24 = SparkFun110309:M02: Header 2 Standard 2-pin 0.1" header. Use with straight break away headers (SKU : PRT-00116), right angle break away headers (PRT-00553), swiss pins (PRT-00743), machine pins (PRT-00117), and female headers (PRT-00115). Molex polarized connector foot print use with SKU : PRT-08233 with associated crimp pins and housings.
JP5-JP9 = SparkFun110309:M03: Header 3 Standard 3-pin 0.1" header. Use with straight break away headers (SKU : PRT-00116), right angle break away headers (PRT-00553), swiss pins (PRT-00743), machine pins (PRT-00117), and female headers (PRT-00115). Molex polarized connector foot print use with SKU : PRT-08232 with associated crimp pins and housings.
JP10 JP12-JP14 = SparkFun:STAND-OFF: Stand Off This is the mechanical footprint for a #4 phillips button head screw. Use the keepout ring to avoid running the screw head into surrounding components. SKU : PRT-00447
JP11 = SparkFun:M16
JP15 = PAS:4PINH0.197
JP16-JP20 = SparkFun:JUMPER-3
JP21 = SparkFun:M06: Header 6 Standard 6-pin 0.1" header. Use with straight break away headers (SKU : PRT-00116), right angle break away headers (PRT-00553), swiss pins (PRT-00743), machine pins (PRT-00117), and female headers (PRT-00115). Molex polarized connector foot print use with SKU : PRT-08094 with associated crimp pins and housings. NOTES ON THE VARIANTS LOCK and LOCK_LONGPADS... This footprint was designed to help hold the alignment of a through-hole component (i.e. 6-pin header) while soldering it into place. You may notice that each hole has been shifted either up or down by 0.005 of an inch from it's more standard position (which is a perfectly straight line). This slight alteration caused the pins (the squares in the middle) to touch the edges of the holes. Because they are alternating, it causes a "brace" to hold the component in place. 0.005 has proven to be the perfect amount of "off-center" position when using our standard breakaway headers. Although looks a little odd when you look at the bare footprint, once you have a header in there, the alteration is very hard to notice. Also, if you push a header all the way into place, it is covered up entirely on the bottom side. This idea of altering the position of holes to aid alignment will be further integrated into the Sparkfun Library for other footprints. It can help hold any component with 3 or more connection pins.
JP22 JP23 = SparkFun:M03: Header 3 Standard 3-pin 0.1" header. Use with straight break away headers (SKU : PRT-00116), right angle break away headers (PRT-00553), swiss pins (PRT-00743), machine pins (PRT-00117), and female headers (PRT-00115). Molex polarized connector foot print use with SKU : PRT-08232 with associated crimp pins and housings.
L1-L3 = SparkFun:INDUCTOR: Inductors Basic Inductor/Choke - 0603 and 1206. Footprints are not proven and vary greatly between part numbers.
L4 = Jeff:L-US: Inductor
LED1 = Jeff:LED
LSP1-LSP8 LSP17-LSP22 = solpad:SE14: SOLDER PAD E1553, drill 1,4mm, distributor Buerklin, 07F820
PROG1 = vanossj:AVR_ISP_PDI
Q1 = SparkFun:CRYSTAL: Crystals Various standard crystals. Proven footprints. Spark Fun Electronics SKU : COM-00534
Q2-Q13 Q16 Q17 = ads4:MOSFET-N: N-Channel MOSFET
R1 R2 = SparkFun:RESISTOR: Resistor Basic schematic elements and footprints for 0603, 1206, and PTH 1/10th watt (small) resistors.
R3-R75 R77-R84 = rcl:R-US_: RESISTOR, American symbol
R76 = pot:TRIM_US-: POTENTIOMETER
SJ2-SJ5 = SparkFun110309:SOLDERJUMPER: Solder Jumper Standard SMD solder jumper. Used to automate production. Two varients : Normally Open and Normally Closed are the same, but have different paste layers. NC will have a large amount of paste and should jumper during reflow.
SV1 = con-lstb:MA12-2: PIN HEADER
SV2 SV3 = con-lstb:MA04-2: PIN HEADER
SW1 = Mouse Power:TL1015
T1-T10 = ads4:TESTPOINT: Test point
U1 = SparkFun:NRF24L01: 2.4GHz Low Power Transceiver This is the very popular, low cost, very low power RF transceiver from Nordic Semiconductor. Simple SPI interface. SKU: COM-00690
X1 = con-subd:F09: SUB-D; OC_FARNELL: unknown; OC_NEWARK: unknown